# Altium project Master Schematic.PrjPcb
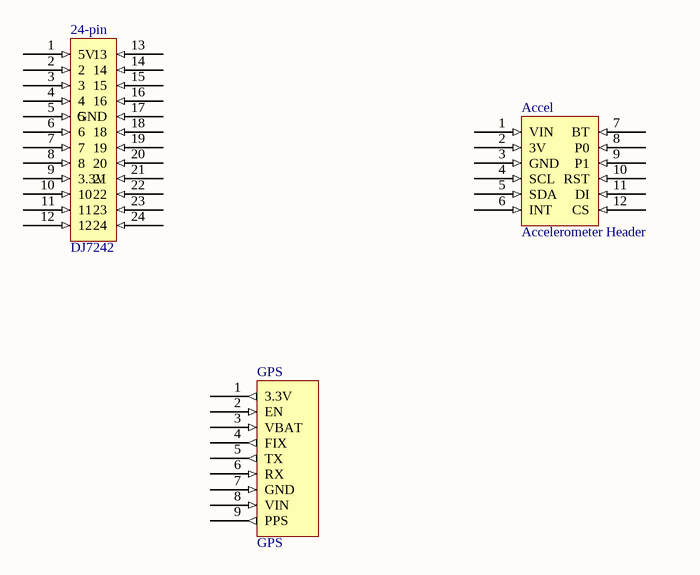
[diagram p0: Test Fit Schematic.SchDoc]
1 sheet, 3 parts. Net scope: global (net labels, ports and power ports of the same name join across sheets).
Board file: Test Fit Schematic.PcbDoc

## Sheet Test Fit Schematic.SchDoc
size A; SheetNumber: 2; SheetTotal: 2

### Parts
24-pin  DJ7242  [DJ7242-Footprint-1]
Accel  Accelerometer Header  [Accelerometer Header-Footprint-1]
GPS  GPS  [GPS-Footprint-1]

### Nets

Not connected (* = marked no-connect by the designer): 24-pin 1(5V) 2 3 4 5 6 7 8 9(3.3V) 10 11 12 13 14 15 16 17(GND) 18 19 20 21 22 23 24; Accel 1(VIN) 2(3V) 3(GND) 4(SCL) 5(SDA) 6(INT) 7(BT) 8(P0) 9(P1) 10(RST) 11(DI) 12(CS); GPS 1(3.3V) 2(EN) 3(VBAT) 4(FIX) 5(TX) 6(RX) 7(GND) 8(VIN) 9(PPS)

### Library data of the parts
24-pin = CMP-00030-00002-2: 24-pin connector
Accel = CMP-002-00071-2: Header for Adafruit Accelerometer
GPS = CMP-002-00072-1: Adafruit GPS chip